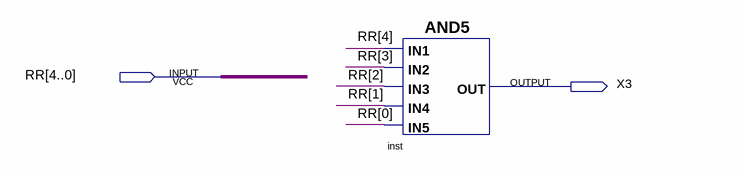
[diagram p0: schematic sheet]
// Quartus schematic KC4.bdf as structural Verilog: 1 symbols, 2 pins
module KC4 (
  input  [4:0] RR,
  output X3
);

  and inst (X3, RR[4], RR[3], RR[2], RR[1], RR[0]);
endmodule
